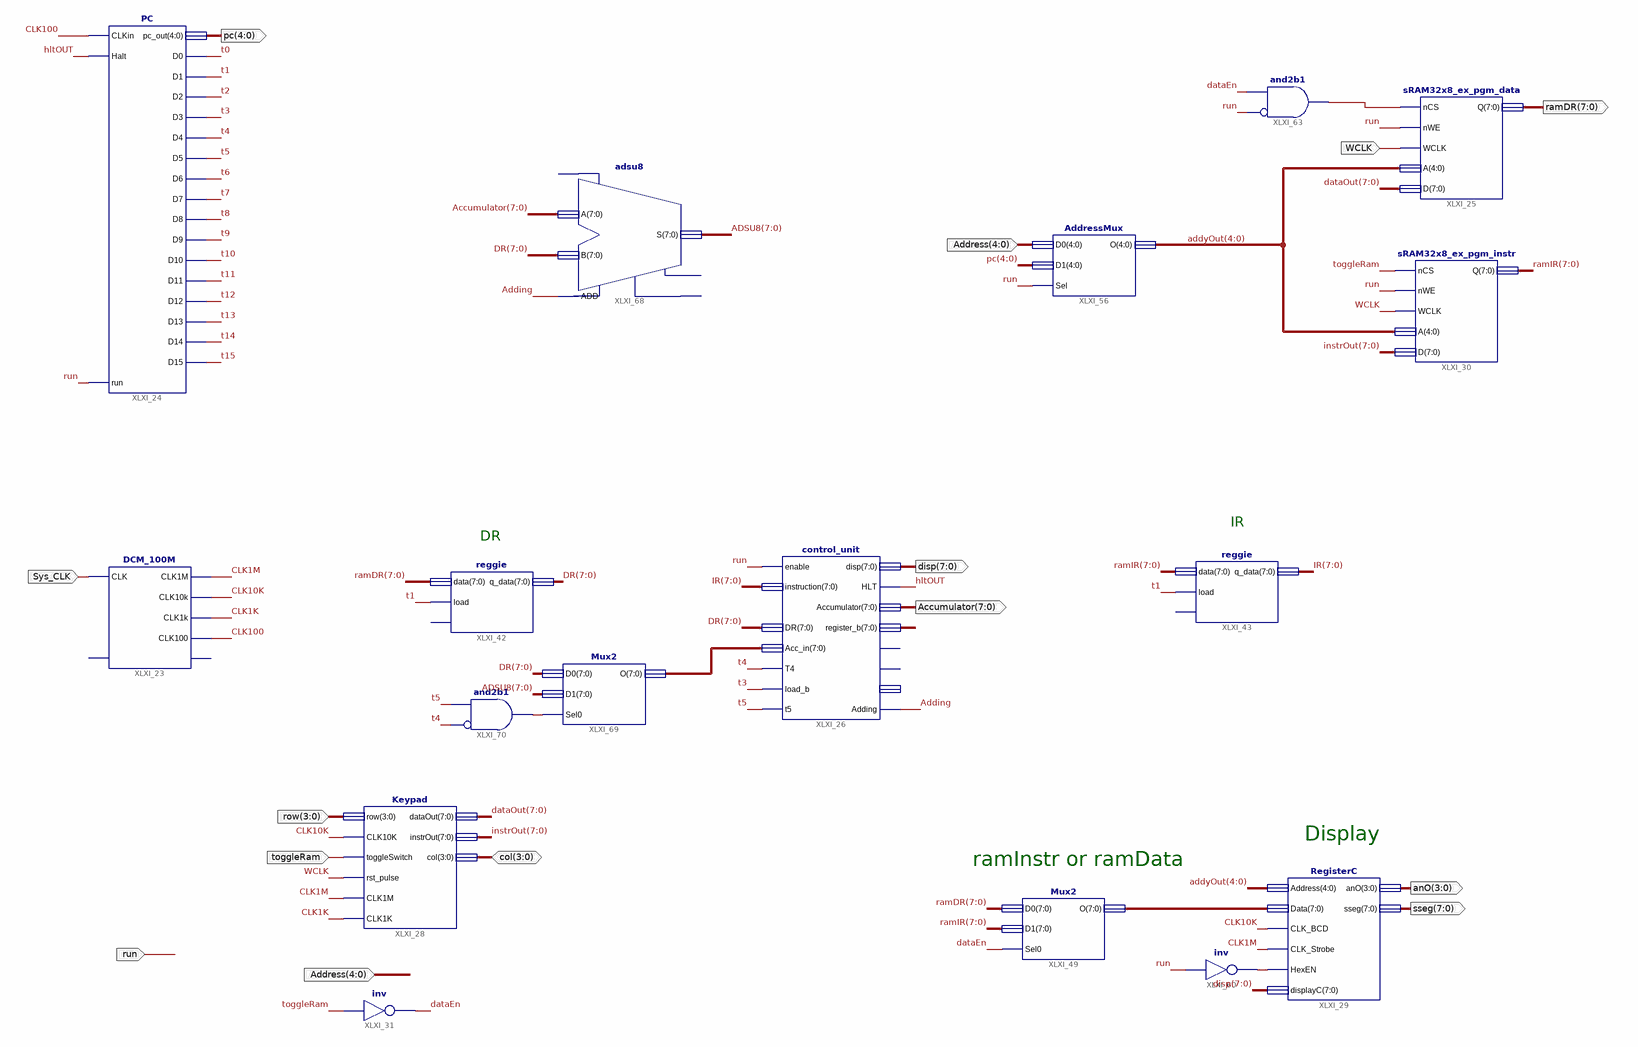
[diagram p0: schematic sheet 1]
// Xilinx ISE schematic Computer.sch (spartan3e) as structural Verilog: 17 symbols, 13 ports
module Computer (
  input  WCLK,
  input  [3:0] row,
  input  Sys_CLK,
  input  [4:0] Address,
  input  toggleRam,
  input  run,
  inout  [3:0] col,
  output [4:0] pc,
  output [7:0] disp,
  output [7:0] Accumulator,
  output [7:0] sseg,
  output [3:0] anO,
  output [7:0] ramDR
);

  wire Adding, CLK1K, CLK1M, CLK10K, CLK100, dataEn, hltOUT, t0, t1, t2, t3, t4, t5, t6, t7, t8, t9, t10,
       t11, t12, t13, t14, t15, XLXN_129, XLXN_141, XLXN_168;
  wire [4:0] addyOut;
  wire [7:0] ADSU8, dataOut, DR, instrOut, IR, ramIR, XLXN_60, XLXN_137, XLXN_167;

  DCM_100M XLXI_23 (.CLK(Sys_CLK), .CLK1M(CLK1M), .CLK10k(CLK10K), .CLK1k(CLK1K), .CLK100(CLK100));  // open: RST, CLK1
  PC XLXI_24 (
    .CLKin(CLK100), .Halt(hltOUT), .run(run), .D3(t3), .D0(t0), .D1(t1), .D2(t2), .D4(t4), .D5(t5), .D6(t6),
    .D7(t7), .D8(t8), .D9(t9), .D10(t10), .D11(t11), .D12(t12), .D13(t13), .D14(t14), .D15(t15), .pc_out(pc));
  control_unit XLXI_26 (
    .enable(run), .instruction(IR), .DR(DR), .HLT(hltOUT), .Accumulator(Accumulator), .disp(disp),
    .register_b(XLXN_60), .Acc_in(XLXN_167), .T4(t4), .load_b(t3), .t5(t5), .Adding(Adding));  // open: LDA, RST, Status
  Keypad XLXI_28 (
    .CLK10K(CLK10K), .CLK1K(CLK1K), .CLK1M(CLK1M), .col(col), .dataOut(dataOut), .instrOut(instrOut),
    .row(row), .rst_pulse(WCLK), .toggleSwitch(toggleRam));
  not XLXI_31 (dataEn, toggleRam);
  RegisterC XLXI_29 (
    .HexEN(XLXN_129), .CLK_BCD(CLK10K), .Data(XLXN_137), .CLK_Strobe(CLK1M), .Address(addyOut), .sseg(sseg),
    .anO(anO), .displayC(disp));
  reggie XLXI_42 (.data(ramDR), .load(t1), .q_data(DR));  // open: clear
  reggie XLXI_43 (.data(ramIR), .load(t1), .q_data(IR));  // open: clear
  not XLXI_60 (XLXN_129, run);
  Mux2 XLXI_49 (.D0(ramDR), .D1(ramIR), .O(XLXN_137), .Sel0(dataEn));
  sRAM32x8_ex_pgm_data XLXI_25 (.nCS(XLXN_141), .nWE(run), .WCLK(WCLK), .A(addyOut), .D(dataOut), .Q(ramDR));
  sRAM32x8_ex_pgm_instr XLXI_30 (.nCS(toggleRam), .nWE(run), .WCLK(WCLK), .A(addyOut), .D(instrOut), .Q(ramIR));
  AddressMux XLXI_56 (.D0(Address), .D1(pc), .Sel(run), .O(addyOut));
  and XLXI_63 (XLXN_141, ~run, dataEn);  // and2b1
  adsu8 XLXI_68 (.A(Accumulator), .ADD(Adding), .B(DR), .S(ADSU8));  // open: CI, CO, OFL
  Mux2 XLXI_69 (.D0(DR), .D1(ADSU8), .O(XLXN_167), .Sel0(XLXN_168));
  and XLXI_70 (XLXN_168, ~t4, t5);  // and2b1

  // Notes on the sheet:
  //   IR
  //   DR
  //   Display
  //   ramInstr or ramData
endmodule
